# EAGLE design HunterRemote2 (EAGLE 9.6.2)
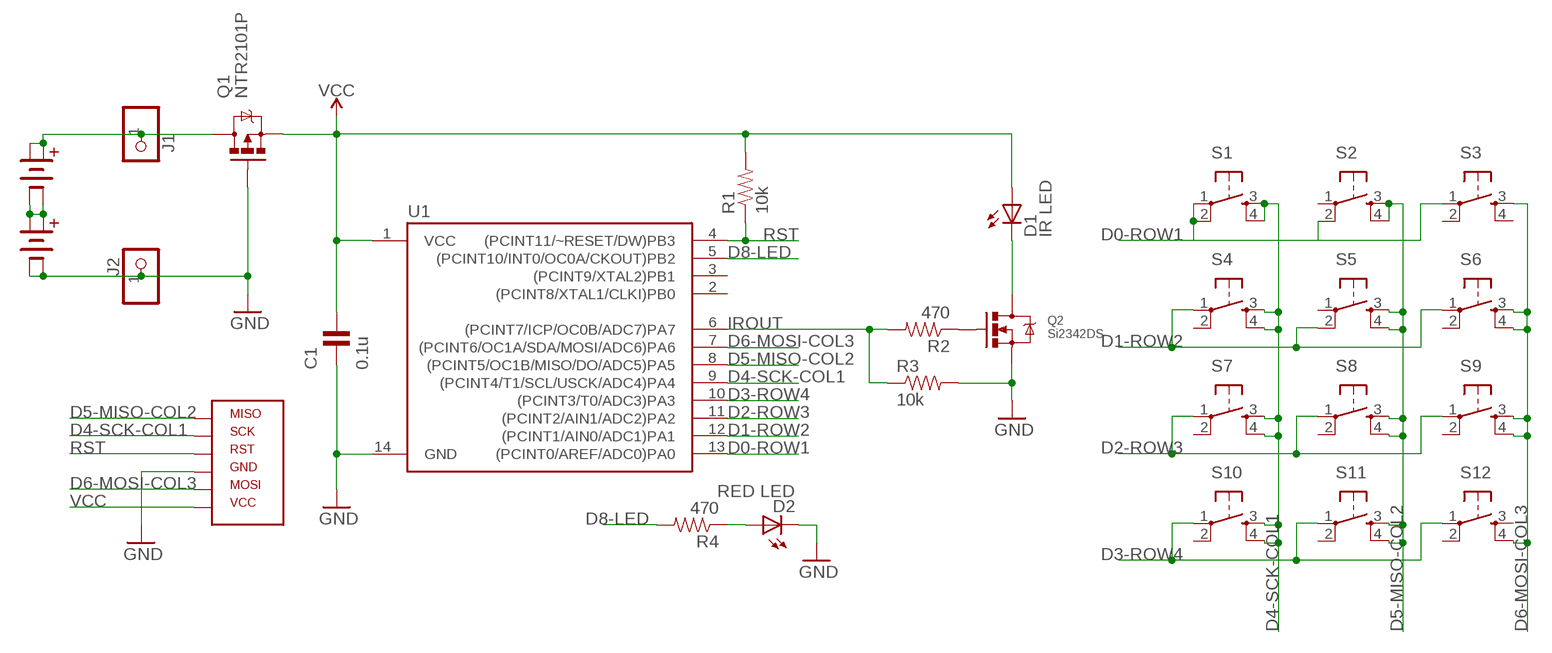
[diagram p0: schematic, sheet 1]

## Parts
B1  BATTERYAAA-KEYSTONE-55TR  [KEYSTONE_55TR_AAA]
B2  BATTERYAAA-KEYSTONE-55TR  [KEYSTONE_55TR_AAA]
C1  0.1u  CAPACITOR0805  [C0805]
D1  IR LED  LED5MM_RIGHTANGLE  [LED5MM-90]
D2  RED LED  LED0805-RED  [LED-0805-RED]
J1  PINHD-1X1  [1X01]
J2  PINHD-1X1  [1X01]
Q1  NTR2101P  MOSFET_P_CH  [SOT23-3A]
Q2  Si2342DS  MOSFET_N_CHSOT23-3  [SOT23-3A]
R1  10k  RESISTORR0805-SMD  [R0805]
R2  470  RESISTORR0805-SMD  [R0805]
R3  10k  RESISTORR0805-SMD  [R0805]
R4  470  RESISTORR0805-SMD  [R0805]
S1  TAC_SWITCHSMD_5X5_LOW  [TACTILE_SWITCH_SMD_5X5_LOW]
S2  TAC_SWITCHSMD_5X5_LOW  [TACTILE_SWITCH_SMD_5X5_LOW]
S3  TAC_SWITCHSMD_5X5_LOW  [TACTILE_SWITCH_SMD_5X5_LOW]
S4  TAC_SWITCHSMD_5X5_LOW  [TACTILE_SWITCH_SMD_5X5_LOW]
S5  TAC_SWITCHSMD_5X5_LOW  [TACTILE_SWITCH_SMD_5X5_LOW]
S6  TAC_SWITCHSMD_5X5_LOW  [TACTILE_SWITCH_SMD_5X5_LOW]
S7  TAC_SWITCHSMD_5X5_LOW  [TACTILE_SWITCH_SMD_5X5_LOW]
S8  TAC_SWITCHSMD_5X5_LOW  [TACTILE_SWITCH_SMD_5X5_LOW]
S9  TAC_SWITCHSMD_5X5_LOW  [TACTILE_SWITCH_SMD_5X5_LOW]
S10  TAC_SWITCHSMD_5X5_LOW  [TACTILE_SWITCH_SMD_5X5_LOW]
S11  TAC_SWITCHSMD_5X5_LOW  [TACTILE_SWITCH_SMD_5X5_LOW]
S12  TAC_SWITCHSMD_5X5_LOW  [TACTILE_SWITCH_SMD_5X5_LOW]
U1  ATTINY84  [SO14]
U$1  AVR_ICSP_6PSTRAIGHT  [AVR_ICSP_6P_SMD_V2]

## Nets
D0-ROW1: S1.1 S1.2 S2.2 S3.1 U1.13((PCINT0/AREF/ADC0)PA0)
D1-ROW2: S4.1 S5.2 S6.1 U1.12((PCINT1/AIN0/ADC1)PA1)
D2-ROW3: S7.1 S8.1 S9.1 U1.11((PCINT2/AIN1/ADC2)PA2)
D3-ROW4: S10.1 S11.1 S12.1 U1.10((PCINT3/T0/ADC3)PA3)
D4-SCK-COL1: S1.3 S1.4 S4.3 S4.4 S7.3 S7.4 S10.3 S10.4 U1.9((PCINT4/T1/SCL/USCK/ADC4)PA4) U$1.SCK(P$SCK)
D5-MISO-COL2: S2.3 S2.4 S5.3 S5.4 S8.3 S8.4 S11.3 S11.4 U1.8((PCINT5/OC1B/MISO/DO/ADC5)PA5) U$1.MISO(P$MISO)
D6-MOSI-COL3: S3.3 S6.3 S6.4 S9.3 S9.4 S12.4 U1.7((PCINT6/OC1A/SDA/MOSI/ADC6)PA6) U$1.MOSI(P$MOSI)
D8-LED: R4.2 U1.5((PCINT10/INT0/OC0A/CKOUT)PB2)
GND: B1.NEG1 B1.NEG2 C1.1 D2.C J2.1 Q1.1(G) Q2.2(S) R3.2 U1.14(GND) U$1.GND(P$GND)
IROUT: R2.2 R3.1 U1.6((PCINT7/ICP/OC0B/ADC7)PA7)
N$1: B2.POS1 B2.POS2 J1.1 Q1.3(D)
N$2: Q2.1(G) R2.1
N$3: D1.C Q2.3(D)
N$4: B1.POS1 B1.POS2 B2.NEG1 B2.NEG2
N$5: D2.A R4.1
RST: R1.1 U1.4((PCINT11/~RESET/DW)PB3) U$1.RST(P$RST)
VCC: C1.2 D1.A Q1.2(S) R1.2 U1.1(VCC) U$1.VCC(P$VCC)
Unconnected: S2.1 S3.2 S3.4 S4.2 S5.1 S6.2 S7.2 S8.2 S9.2 S10.2 S11.2 S12.2 S12.3 U1.2((PCINT8/XTAL1/CLKI)PB0) U1.3((PCINT9/XTAL2)PB1)

## Library data of the parts
B1 B2 = My Custom Parts:BATTERY
C1 = My Custom Parts:CAPACITOR
D1 D2 = My Custom Parts:LED
J1 J2 = pinhead:PINHD-1X1: PIN HEADER
Q1 = My Custom Parts:MOSFET_P_CH
Q2 = My Custom Parts:MOSFET_N_CH
R1-R4 = My Custom Parts:RESISTOR: SMD chip resistors
S1-S12 = My Custom Parts:TAC_SWITCH: Momentary Switch Button commonly used for reset or general input. Spark Fun Electronics SKU : COM-00097 SMT- SWCH-08247
U1 = My Custom Parts:ATTINY84: Atmel 14-pin 2/4/8kB flash uC
U$1 = My Custom Parts:AVR_ICSP_6P

## Board
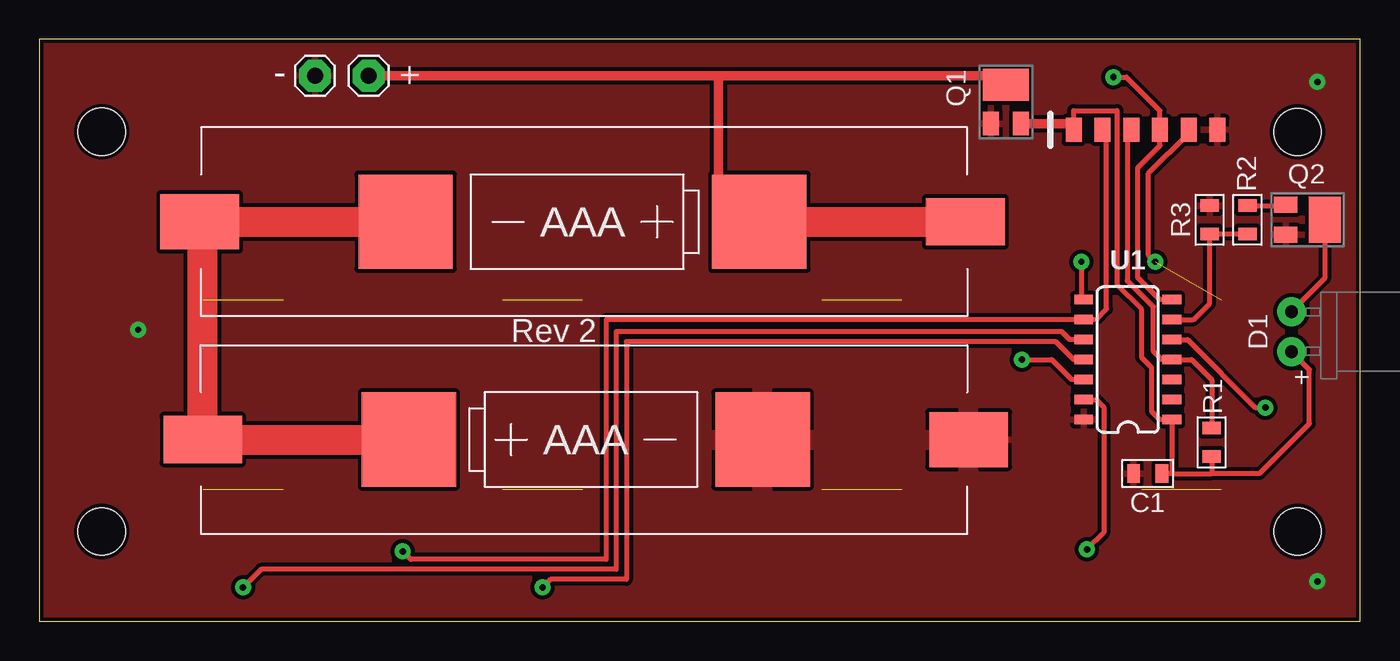
[diagram p1: board, top side]
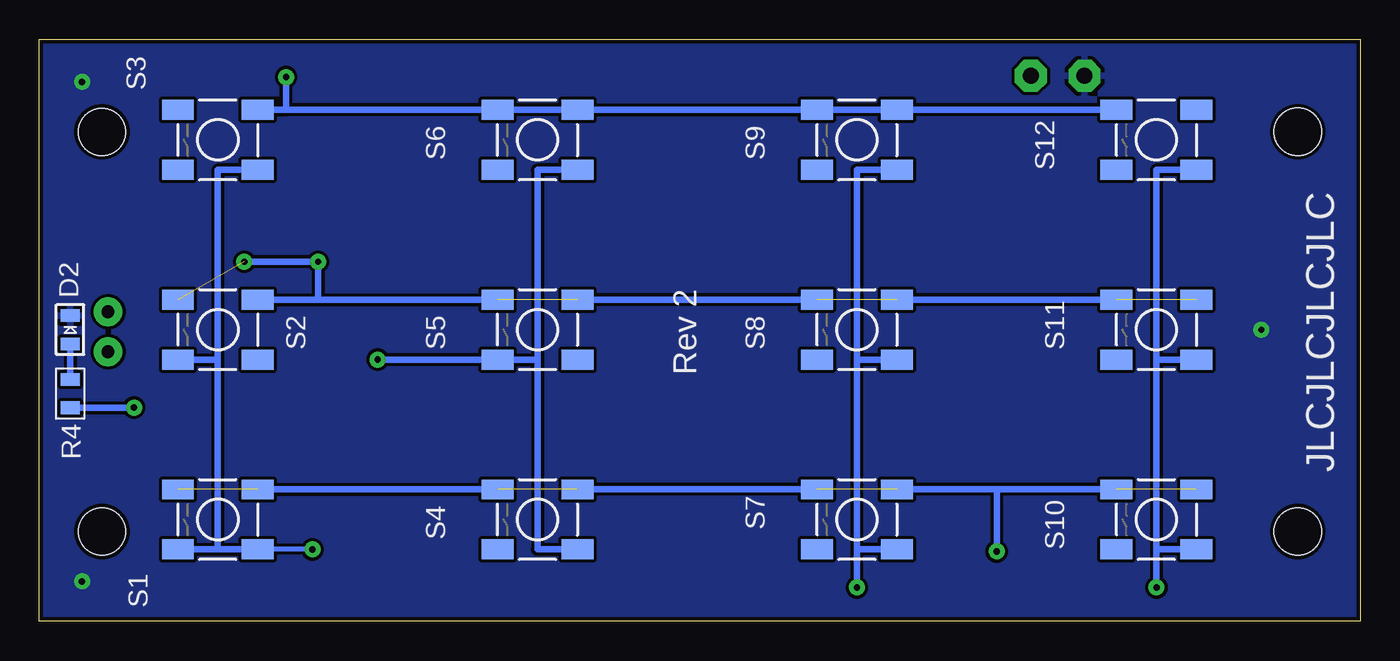
[diagram p2: board, bottom side, seen from below]

Size 84 x 37 mm. Coordinates in mm from the lower left corner, seen from the top.
Outline: 0,0 84,0 84,37 0,37 0,0
Copper layers (1*16): Top 0.035mm / dielectric 1mm / Bottom 0.035mm
Design rules "ITead_rule *": minimum track width 10mil, minimum drill 16mil, track to track 8mil, track to pad 8mil, pad to pad 8mil, via to via 8mil, smd to smd 0mil, copper to edge 10mil, drill to drill 10mil, minimum pad ring 20mil, minimum via ring 12mil, stop-mask expansion 4mil, vias tented up to drill 100mil, thermal gap 10mil
Holes 3 mm at 80.01,5.71 80.01,31.11 3.97,31.12 3.97,5.71

### Footprints (pad centres in the part's own frame; a part is rotated, then mirrored left to right if it is on the bottom)
KEYSTONE_55TR_AAA = smd 5 x 3.5: NEG1 -24.35,0 | smd 6 x 6: NEG2 -11.25,0; POS2 11.25,0 | smd 5 x 3: POS1 24.35,0
C0805 = smd 0.8 x 1.2: 1 -0.9,0; 2 0.9,0
LED5MM-90 = drill 0.813: A 1.27,0; C -1.27,0
LED-0805-RED = smd 0.8 x 1.2: A -0.9,0; C 0.9,0
1X01 = drill 1.016 octagon: 1 0,0
SOT23-3A = smd 1 x 1.5: 1 -0.95,-1.254; 2 0.95,-1.254 | smd 2.9 x 2.05: 3 0,1.227
R0805 = smd 0.8 x 1.2: 1 -0.9,0; 2 0.9,0
TACTILE_SWITCH_SMD_5X5_LOW = smd 2.032 x 1.27: 1 -2.54,1.905; 2 2.54,1.905; 3 -2.54,-1.905; 4 2.54,-1.905
SO14 = smd 0.6 x 1.2: 1 -3.81,-2.8; 2 -2.54,-2.8; 3 -1.27,-2.8; 4 0,-2.8; 5 1.27,-2.8; 6 2.54,-2.8; 7 3.81,-2.8; 8 3.81,2.8; 9 2.54,2.8; 10 1.27,2.8; 11 0,2.8; 12 -1.27,2.8; 13 -2.54,2.8; 14 -3.81,2.8
AVR_ICSP_6P_SMD_V2 = smd 1.016 x 1.524: GND 0,0; MISO 1.829,0; MOSI 3.658,0; RST 5.486,0; SCK 7.315,0; VCC 9.144,0

### Placement (x,y rotation side)
B1  34.75,11.56 180 top
B2  34.54,25.4 0 top
C1  70.48,9.4 0 top
D1  79.63,18.41 270 top
D2  82.04,18.54 90 bottom
J1  20.95,34.67 0 top
J2  17.53,34.67 0 top
Q1  61.47,32.89 0 top
Q2  80.52,25.53 270 top
R1  74.55,11.38 270 top
R2  76.83,25.53 270 top
R3  74.42,25.53 90 top
R4  82.04,14.48 270 bottom
S1  72.64,6.48 180 bottom
S2  72.64,18.54 180 bottom
S3  72.64,30.61 180 bottom
S4  52.32,6.48 180 bottom
S5  52.32,18.54 180 bottom
S6  52.32,30.61 180 bottom
S7  32,6.48 180 bottom
S8  32,18.54 180 bottom
S9  32,30.61 180 bottom
S10  12.95,6.48 180 bottom
S11  12.95,18.54 180 bottom
S12  12.95,30.61 180 bottom
U1  69.22,16.64 90 top
U$1  74.92,31.25 180 top

### Tracks (layer width: path | path; a pad name or v marks a point on that pad's centre or on a via)
D0-ROW1  (via drill 0.41)
  Top 0.305: v66.62,4.57 67.69,5.64 67.69,13.61 67.21,14.1 U1.13
  Bottom 0.305: v66.62,4.57 S1.1
  Bottom 0.406: S3.1 72.64,28.7 72.64,16.64 | 72.64,4.57 S1.1 | 72.64,16.64 72.64,4.57 | S2.2 72.64,16.64 | S1.2 72.64,4.57
D1-ROW2  (via drill 0.41)
  Top 0.305: U1.12 65.66,15.37 64.39,16.64 v62.48,16.64
  Bottom 0.305: 62.61,16.64 v62.48,16.64
  Bottom 0.406: S6.1 52.32,28.7 52.32,16.64 | S4.1 52.32,4.57 52.32,16.64 | 52.32,16.64 S5.2 62.61,16.64
D2-ROW3  (via drill 0.41)
  Top 0.305: U1.11 65.79,16.64 64.64,17.78 37.34,17.78 37.34,2.67 32.51,2.67 v32,2.16
  Bottom 0.406: S9.1 32,28.7 32,16.64 | S8.1 32,16.64 | S7.1 32,4.57 | 32,4.57 32,16.64 | v32,2.16 32,4.57
D3-ROW4  (via drill 0.41)
  Top 0.305: U1.10 65.53,17.91 65.02,18.41 36.7,18.41 36.7,3.3 14.1,3.3 v12.95,2.16
  Bottom 0.406: S12.1 12.95,28.7 12.95,16.64 | 12.95,16.64 12.95,4.57 | S11.1 12.95,16.64 | S10.1 12.95,4.57 | 12.95,4.57 v12.95,2.16
D4-SCK-COL1  (via drill 0.41)  (4 unrouted)
  Top 0.305: v23.11,4.45 23.62,3.94 36.07,3.94 36.07,19.18 U1.9 67.18,19.18 67.87,19.86 67.87,30.99 U$1.SCK
  Bottom 0.406: S1.3 S4.4 | S7.4 S4.3 | S10.4 23.11,8.38 | 23.11,8.38 S7.3 | v23.11,4.45 23.11,8.38
D5-MISO-COL2  (via drill 0.41)  (4 unrouted)
  Top 0.305: U$1.MISO 73.09,31.03 70.51,28.45 70.51,23.32 v70.97,22.86 | v66.27,22.86 66.27,20.45 U1.8
  Bottom 0.406: S2.3 66.27,20.45 | 66.27,20.45 S5.4 | S11.4 S8.3 | S8.4 S5.3 | 66.27,20.45 v66.27,22.86 v70.97,22.86
D6-MOSI-COL3  (via drill 0.41)
  Top 0.305: U1.7 71.25,20.45 69.85,21.84 69.85,28.83 71.27,30.25 U$1.MOSI 71.27,32.47 69.14,34.59 v68.3,34.59
  Bottom 0.406: S12.4 S9.3 S9.4 S6.3 S6.4 68.3,32.51 | S3.3 68.3,32.51 | 68.3,32.51 v68.3,34.59
D8-LED  (via drill 0.41)
  Top 0.305: U1.5 73.03,17.91 77.34,13.59 v77.98,13.59
  Bottom 0.406: R4.2 77.98,13.58 v77.98,13.59
GND  (via drill 0.41)
  other vias: 6.29,18.54 81.28,2.54 81.28,34.29
  pour Top (isolate 0.254): 0,36.83 83.82,36.83 83.82,0 0,0
  pour Bottom: 0,36.83 83.82,36.83 83.82,0 0,0
  pour Top (isolate 0.254): 39.12,16.26 60.07,16.26 60.07,8.13 39.12,8.13
IROUT
  Top 0.305: U1.6 73.41,19.18 74.42,20.19 R3.1 R2.2
N$1
  Top 0.61: J1.1 43.18,34.67 | 43.18,34.67 43.18,28.01 B2.POS2 | 43.18,34.67 60.92,34.67 Q1.3
  Top 1.905: B2.POS2 B2.POS1
N$2
  Top 0.305: R2.1 79.26,26.43
  Top 0.406: 79.26,26.43 Q2.1
N$3
  Top 0.305: Q2.3 81.75,21.8 D1.C
N$4
  Top 1.016: 10.4,25.4 B2.NEG1
  Top 1.905: 10.4,25.4 B1.POS1 B1.POS2 | B2.NEG1 B2.NEG2
N$5
  Bottom 0.406: D2.A R4.1
RST
  Top 0.305: R1.1 74.55,15.37 73.28,16.64 U1.4 71.37,16.64 70.85,17.16 70.85,20 69.19,21.67 69.19,31 U$1.RST
VCC
  Top 0.305: 72.02,9.4 U1.1 71.25,12.83 70.74,13.34 70.74,16.13 70.1,16.76 70.1,19.84 68.53,21.41 68.53,32.46 65.78,32.46 U$1.VCC 65.39,31.64 | 72.02,9.4 C1.2 | 72.02,9.4 74.55,9.4 | 74.55,9.4 77.6,9.4 80.77,12.57 80.77,16 D1.A | R1.2 74.55,9.4
  Top 0.61: 65.39,31.64 Q1.2

### Text on the board
tPlace: - | +
bPlace: JLCJLCJLCJLC
tNames: Rev 2
bNames: Rev 2